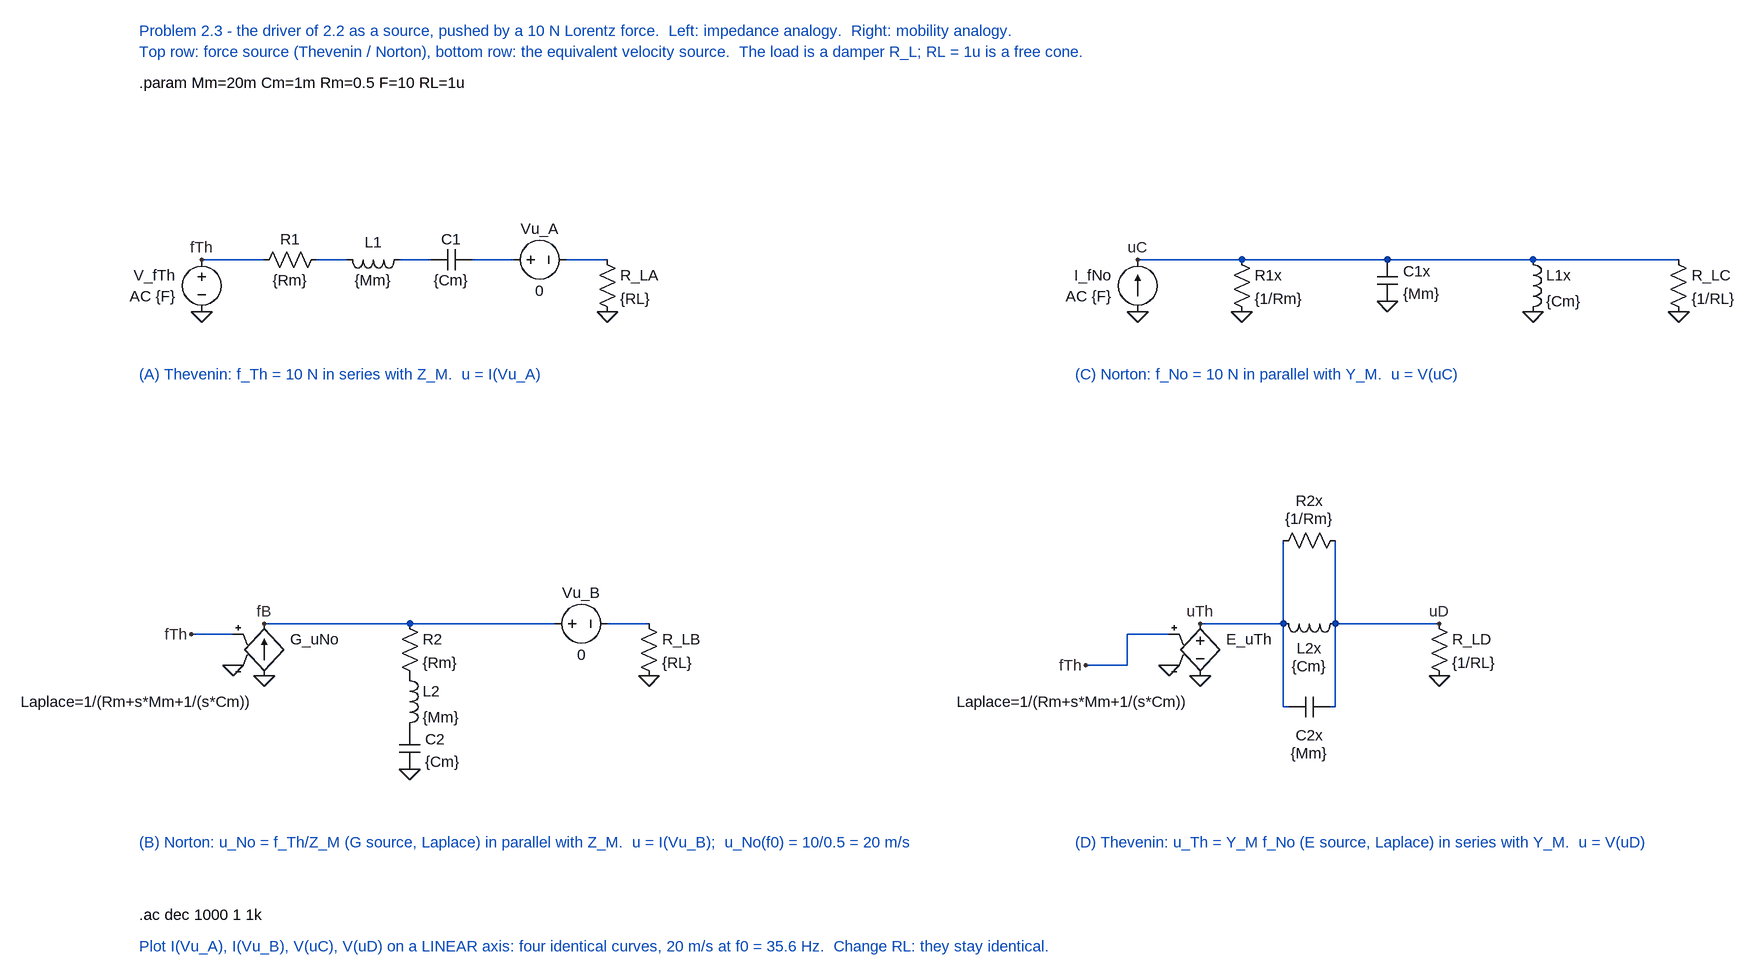
[diagram p0: schematic P2_3_Equivalent_Sources.asc]
P2_3_Equivalent_Sources.asc, the LTspice schematic file:
Version 4
SHEET 1 3000 1600
WIRE 0 0 96 0
WIRE 176 0 224 0
WIRE 304 0 352 0
WIRE 416 0 480 0
WIRE 560 0 624 0
WIRE 48 576 -16 576
WIRE 96 560 544 560
WIRE 624 560 688 560
WIRE 1440 0 2272 0
WIRE 1488 576 1424 576
WIRE 1424 576 1424 624
WIRE 1424 624 1360 624
WIRE 1536 560 1664 560
WIRE 1664 432 1664 688
WIRE 1744 432 1744 688
WIRE 1664 688 1672 688
WIRE 1736 688 1744 688
WIRE 1744 560 1904 560
FLAG 0 80 0
FLAG 0 0 fTh
FLAG 624 80 0
FLAG 96 640 0
FLAG 48 624 0
FLAG -16 576 fTh
FLAG 96 560 fB
FLAG 320 784 0
FLAG 688 640 0
FLAG 1440 80 0
FLAG 1440 0 uC
FLAG 1600 80 0
FLAG 1824 64 0
FLAG 2048 80 0
FLAG 2272 80 0
FLAG 1536 640 0
FLAG 1488 624 0
FLAG 1360 624 fTh
FLAG 1536 560 uTh
FLAG 1904 560 uD
FLAG 1904 640 0
SYMBOL voltage 0 -16 R0
WINDOW 0 -40 40 Right 2
WINDOW 3 -40 72 Right 2
SYMATTR InstName V_fTh
SYMATTR Value AC {F}
SYMBOL res 192 -16 R90
WINDOW 0 0 56 VBottom 2
WINDOW 3 32 56 VTop 2
SYMATTR InstName R1
SYMATTR Value {Rm}
SYMBOL ind 320 -16 R90
WINDOW 0 5 56 VBottom 2
WINDOW 3 32 56 VTop 2
SYMATTR InstName L1
SYMATTR Value {Mm}
SYMATTR SpiceLine Rser=0
SYMBOL cap 416 -16 R90
WINDOW 0 0 32 VBottom 2
WINDOW 3 32 32 VTop 2
SYMATTR InstName C1
SYMATTR Value {Cm}
SYMBOL voltage 464 0 R270
WINDOW 0 32 56 VTop 2
WINDOW 3 -32 56 VBottom 2
SYMATTR InstName Vu_A
SYMATTR Value 0
SYMBOL res 608 -16 R0
SYMATTR InstName R_LA
SYMATTR Value {RL}
SYMBOL g 96 544 R0
WINDOW 0 40 40 Left 2
WINDOW 3 -16 136 Right 2
SYMATTR InstName G_uNo
SYMATTR Value Laplace=1/(Rm+s*Mm+1/(s*Cm))
SYMBOL res 304 544 R0
SYMATTR InstName R2
SYMATTR Value {Rm}
SYMBOL ind 304 624 R0
SYMATTR InstName L2
SYMATTR Value {Mm}
SYMATTR SpiceLine Rser=0
SYMBOL cap 304 720 R0
WINDOW 0 40 18 Left 2
WINDOW 3 40 52 Left 2
SYMATTR InstName C2
SYMATTR Value {Cm}
SYMBOL voltage 528 560 R270
WINDOW 0 32 56 VTop 2
WINDOW 3 -32 56 VBottom 2
SYMATTR InstName Vu_B
SYMATTR Value 0
SYMBOL res 672 544 R0
SYMATTR InstName R_LB
SYMATTR Value {RL}
SYMBOL current 1440 80 R180
WINDOW 0 40 56 Left 2
WINDOW 3 40 24 Left 2
SYMATTR InstName I_fNo
SYMATTR Value AC {F}
SYMBOL res 1584 -16 R0
SYMATTR InstName R1x
SYMATTR Value {1/Rm}
SYMBOL cap 1808 0 R0
WINDOW 0 40 18 Left 2
WINDOW 3 40 52 Left 2
SYMATTR InstName C1x
SYMATTR Value {Mm}
SYMBOL ind 2032 -16 R0
SYMATTR InstName L1x
SYMATTR Value {Cm}
SYMATTR SpiceLine Rser=0
SYMBOL res 2256 -16 R0
SYMATTR InstName R_LC
SYMATTR Value {1/RL}
SYMBOL e 1536 544 R0
WINDOW 0 40 40 Left 2
WINDOW 3 -16 136 Right 2
SYMATTR InstName E_uTh
SYMATTR Value Laplace=1/(Rm+s*Mm+1/(s*Cm))
SYMBOL ind 1760 544 R90
WINDOW 0 38 56 VTop 2
WINDOW 3 66 56 VTop 2
SYMATTR InstName L2x
SYMATTR Value {Cm}
SYMATTR SpiceLine Rser=0
SYMBOL res 1760 416 R90
WINDOW 0 -30 56 VBottom 2
WINDOW 3 -2 56 VBottom 2
SYMATTR InstName R2x
SYMATTR Value {1/Rm}
SYMBOL cap 1736 672 R90
WINDOW 0 44 32 VTop 2
WINDOW 3 72 32 VTop 2
SYMATTR InstName C2x
SYMATTR Value {Mm}
SYMBOL res 1888 544 R0
SYMATTR InstName R_LD
SYMATTR Value {1/RL}
TEXT -96 -352 Left 2 ;Problem 2.3 - the driver of 2.2 as a source, pushed by a 10 N Lorentz force.  Left: impedance analogy.  Right: mobility analogy.
TEXT -96 -320 Left 2 ;Top row: force source (Thevenin / Norton), bottom row: the equivalent velocity source.  The load is a damper R_L; RL = 1u is a free cone.
TEXT -96 -272 Left 2 !.param Mm=20m Cm=1m Rm=0.5 F=10 RL=1u
TEXT -96 176 Left 2 ;(A) Thevenin: f_Th = 10 N in series with Z_M.  u = I(Vu_A)
TEXT -96 896 Left 2 ;(B) Norton: u_No = f_Th/Z_M (G source, Laplace) in parallel with Z_M.  u = I(Vu_B);  u_No(f0) = 10/0.5 = 20 m/s
TEXT 1344 176 Left 2 ;(C) Norton: f_No = 10 N in parallel with Y_M.  u = V(uC)
TEXT 1344 896 Left 2 ;(D) Thevenin: u_Th = Y_M f_No (E source, Laplace) in series with Y_M.  u = V(uD)
TEXT -96 1008 Left 2 !.ac dec 1000 1 1k
TEXT -96 1056 Left 2 ;Plot I(Vu_A), I(Vu_B), V(uC), V(uD) on a LINEAR axis: four identical curves, 20 m/s at f0 = 35.6 Hz.  Change RL: they stay identical.

The netlist it stands for:
* P2_3_Equivalent_Sources.asc
V_fTh fTh 0 AC {F}
R1 N001 fTh {Rm}
L1 N002 N001 {Mm} Rser=0
C1 N003 N002 {Cm}
Vu_A N003 N004 0
R_LA N004 0 {RL}
G_uNo 0 fB fTh 0 Laplace=1/(Rm+s*Mm+1/(s*Cm))
R2 fB P001 {Rm}
L2 P001 P002 {Mm} Rser=0
C2 P002 0 {Cm}
Vu_B fB N005 0
R_LB N005 0 {RL}
I_fNo 0 uC AC {F}
R1x uC 0 {1/Rm}
C1x uC 0 {Mm}
L1x uC 0 {Cm} Rser=0
R_LC uC 0 {1/RL}
E_uTh uTh 0 fTh 0 Laplace=1/(Rm+s*Mm+1/(s*Cm))
L2x uD uTh {Cm} Rser=0
R2x uD uTh {1/Rm}
C2x uD uTh {Mm}
R_LD uD 0 {1/RL}
* Problem 2.3 - the driver of 2.2 as a source, pushed by a 10 N Lorentz force.  Left: impedance analogy.  Right: mobility analogy.
* Top row: force source (Thevenin / Norton), bottom row: the equivalent velocity source.  The load is a damper R_L; RL = 1u is a free cone.
.param Mm=20m Cm=1m Rm=0.5 F=10 RL=1u
* (A) Thevenin: f_Th = 10 N in series with Z_M.  u = I(Vu_A)
* (B) Norton: u_No = f_Th/Z_M (G source, Laplace) in parallel with Z_M.  u = I(Vu_B);  u_No(f0) = 10/0.5 = 20 m/s
* (C) Norton: f_No = 10 N in parallel with Y_M.  u = V(uC)
* (D) Thevenin: u_Th = Y_M f_No (E source, Laplace) in series with Y_M.  u = V(uD)
.ac dec 1000 1 1k
* Plot I(Vu_A), I(Vu_B), V(uC), V(uD) on a LINEAR axis: four identical curves, 20 m/s at f0 = 35.6 Hz.  Change RL: they stay identical.
.backanno
.end